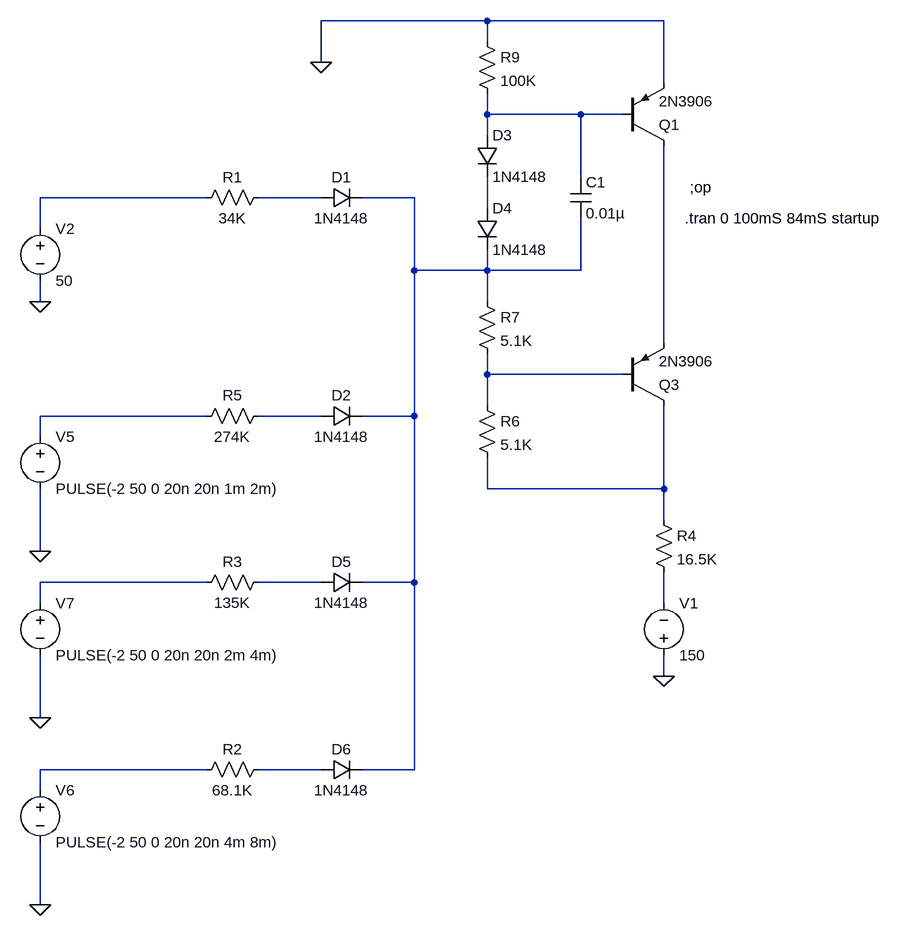
[diagram p0: schematic intensifier4.asc]
intensifier4.asc, the LTspice schematic file:
Version 4
SHEET 1 1476 1652
WIRE 640 -496 384 -496
WIRE 912 -496 640 -496
WIRE 640 -464 640 -496
WIRE 384 -432 384 -496
WIRE 912 -400 912 -496
WIRE 640 -352 640 -384
WIRE 784 -352 640 -352
WIRE 848 -352 784 -352
WIRE 640 -320 640 -352
WIRE 784 -256 784 -352
WIRE 208 -224 -48 -224
WIRE 384 -224 288 -224
WIRE 528 -224 448 -224
WIRE 640 -208 640 -256
WIRE -48 -176 -48 -224
WIRE 528 -112 528 -224
WIRE 640 -112 640 -144
WIRE 640 -112 528 -112
WIRE 784 -112 784 -192
WIRE 784 -112 640 -112
WIRE -48 -64 -48 -96
WIRE 640 -64 640 -112
WIRE 912 0 912 -304
WIRE 640 48 640 16
WIRE 848 48 640 48
WIRE 640 96 640 48
WIRE 208 112 -48 112
WIRE 384 112 288 112
WIRE 528 112 528 -112
WIRE 528 112 448 112
WIRE -48 144 -48 112
WIRE 640 224 640 176
WIRE 912 224 912 96
WIRE 912 224 640 224
WIRE 912 272 912 224
WIRE -48 320 -48 224
WIRE 208 368 -48 368
WIRE 384 368 288 368
WIRE 528 368 528 112
WIRE 528 368 448 368
WIRE -48 400 -48 368
WIRE 912 400 912 352
WIRE 912 512 912 480
WIRE -48 576 -48 480
WIRE 208 656 -48 656
WIRE 384 656 288 656
WIRE 528 656 528 368
WIRE 528 656 448 656
WIRE -48 688 -48 656
WIRE -48 864 -48 768
FLAG 912 512 0
FLAG 384 -432 0
FLAG -48 -64 0
FLAG -48 320 0
FLAG -48 576 0
FLAG -48 864 0
SYMBOL pnp 848 -304 M180
SYMATTR InstName Q1
SYMATTR Value 2N3906
SYMBOL pnp 848 96 M180
SYMATTR InstName Q3
SYMATTR Value 2N3906
SYMBOL res 896 256 R0
SYMATTR InstName R4
SYMATTR Value 16.5K
SYMBOL res 624 80 R0
SYMATTR InstName R6
SYMATTR Value 5.1K
SYMBOL res 624 -80 R0
SYMATTR InstName R7
SYMATTR Value 5.1K
SYMBOL diode 624 -320 R0
SYMATTR InstName D3
SYMATTR Value 1N4148
SYMBOL diode 624 -208 R0
SYMATTR InstName D4
SYMATTR Value 1N4148
SYMBOL res 624 -480 R0
SYMATTR InstName R9
SYMATTR Value 100K
SYMBOL voltage 912 496 M180
WINDOW 0 24 96 Left 2
WINDOW 3 24 16 Left 2
WINDOW 123 0 0 Left 0
WINDOW 39 0 0 Left 0
SYMATTR InstName V1
SYMATTR Value 150
SYMBOL voltage -48 -192 R0
WINDOW 123 0 0 Left 0
WINDOW 39 0 0 Left 0
SYMATTR InstName V2
SYMATTR Value 50
SYMBOL res 192 -208 R270
WINDOW 0 32 56 VTop 2
WINDOW 3 0 56 VBottom 2
SYMATTR InstName R1
SYMATTR Value 34K
SYMATTR SpiceLine tol=1
SYMBOL diode 384 -240 M90
WINDOW 0 0 32 VBottom 2
WINDOW 3 32 32 VTop 2
SYMATTR InstName D1
SYMATTR Value 1N4148
SYMBOL res 304 640 R90
WINDOW 0 0 56 VBottom 2
WINDOW 3 32 56 VTop 2
SYMATTR InstName R2
SYMATTR Value 68.1K
SYMATTR SpiceLine tol=1
SYMBOL res 304 352 R90
WINDOW 0 0 56 VBottom 2
WINDOW 3 32 56 VTop 2
SYMATTR InstName R3
SYMATTR Value 135K
SYMATTR SpiceLine tol=1
SYMBOL res 304 96 R90
WINDOW 0 0 56 VBottom 2
WINDOW 3 32 56 VTop 2
SYMATTR InstName R5
SYMATTR Value 274K
SYMATTR SpiceLine tol=1
SYMBOL diode 384 96 M90
WINDOW 0 0 32 VBottom 2
WINDOW 3 32 32 VTop 2
SYMATTR InstName D2
SYMATTR Value 1N4148
SYMBOL voltage -48 128 R0
WINDOW 123 0 0 Left 0
WINDOW 39 0 0 Left 0
SYMATTR InstName V5
SYMATTR Value PULSE(-2 50 0 20n 20n 1m 2m)
SYMBOL cap 768 -256 R0
SYMATTR InstName C1
SYMATTR Value 0.01µ
SYMATTR SpiceLine V=16 Irms=647m Rser=0.0322889 Lser=0 mfg="KEMET" pn="C0201C103K4PAC" type="X5R"
SYMBOL diode 384 352 M90
WINDOW 0 0 32 VBottom 2
WINDOW 3 32 32 VTop 2
SYMATTR InstName D5
SYMATTR Value 1N4148
SYMBOL voltage -48 384 R0
WINDOW 123 0 0 Left 0
WINDOW 39 0 0 Left 0
SYMATTR InstName V7
SYMATTR Value PULSE(-2 50 0 20n 20n 2m 4m)
SYMBOL diode 384 640 M90
WINDOW 0 0 32 VBottom 2
WINDOW 3 32 32 VTop 2
SYMATTR InstName D6
SYMATTR Value 1N4148
SYMBOL voltage -48 672 R0
WINDOW 123 0 0 Left 0
WINDOW 39 0 0 Left 0
SYMATTR InstName V6
SYMATTR Value PULSE(-2 50 0 20n 20n 4m 8m)
TEXT 952 -240 Left 2 !;op
TEXT 944 -192 Left 2 !.tran 0 100mS 84mS startup

The netlist it stands for:
* intensifier4.asc
Q1 N006 N001 0 0 2N3906
Q3 N010 N007 N006 0 2N3906
R4 N010 N013 16.5K
R6 N007 N010 5.1K
R7 N004 N007 5.1K
D3 N001 N005 1N4148
D4 N005 N004 1N4148
R9 0 N001 100K
V1 0 N013 150
V2 N002 0 50
R1 N002 N003 34K tol=1
D1 N003 N004 1N4148
R2 N015 N014 68.1K tol=1
R3 N012 N011 135K tol=1
R5 N009 N008 274K tol=1
D2 N009 N004 1N4148
V5 N008 0 PULSE(-2 50 0 20n 20n 1m 2m)
C1 N001 N004 0.01µ V=16 Irms=647m Rser=0.0322889 Lser=0 mfg="KEMET" pn="C0201C103K4PAC" type="X5R"
D5 N012 N004 1N4148
V7 N011 0 PULSE(-2 50 0 20n 20n 2m 4m)
D6 N015 N004 1N4148
V6 N014 0 PULSE(-2 50 0 20n 20n 4m 8m)
.model D D
.lib standard.dio
.model NPN NPN
.model PNP PNP
.lib standard.bjt
;op
.tran 0 100mS 84mS startup
.backanno
.end